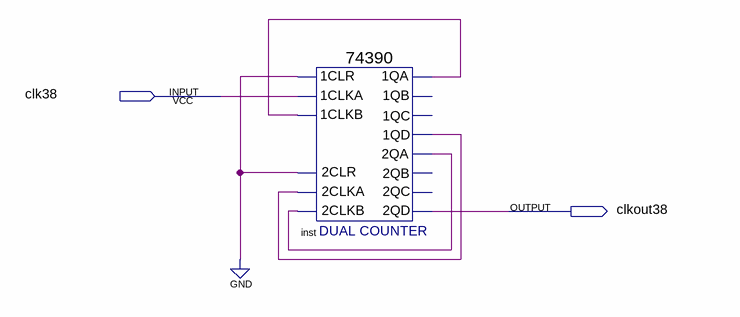
[diagram p0: schematic sheet]
// Quartus schematic m100_38.bdf as structural Verilog: 1 symbols, 2 pins
module m100_38 (
  input  clk38,
  output clkout38
);

  wire inst_1qa, inst_1qd, inst_2qa;

  \74390  inst (
    .\2CLKA (inst_1qd), .\2CLR (1'b0), .\2CLKB (inst_2qa), .\1CLR (1'b0), .\1CLKA (clk38),
    .\1CLKB (inst_1qa), .\1QA (inst_1qa), .\1QD (inst_1qd), .\2QA (inst_2qa), .\2QD (clkout38));  // open: 1QB, 1QC, 2QB, 2QC
endmodule
